# EasyEDA Pro project ProProject_gps打窝船_2025-04-29.epro, board PCB1
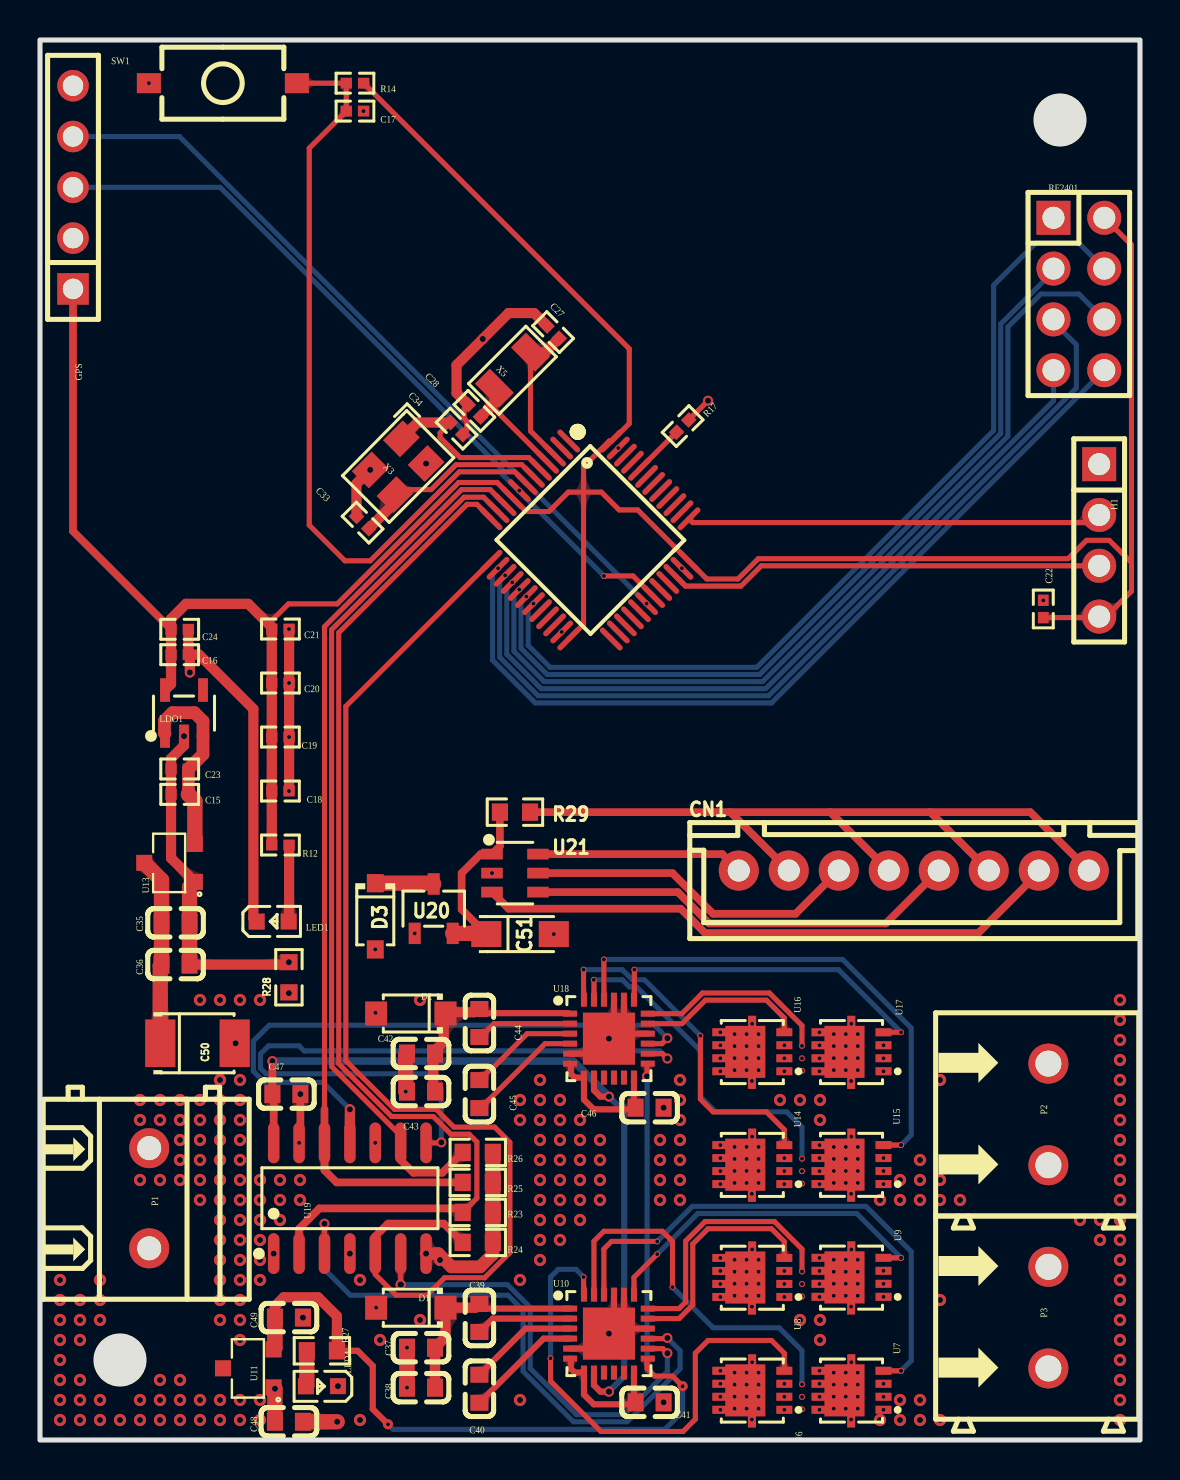
[diagram p4: board, top side]
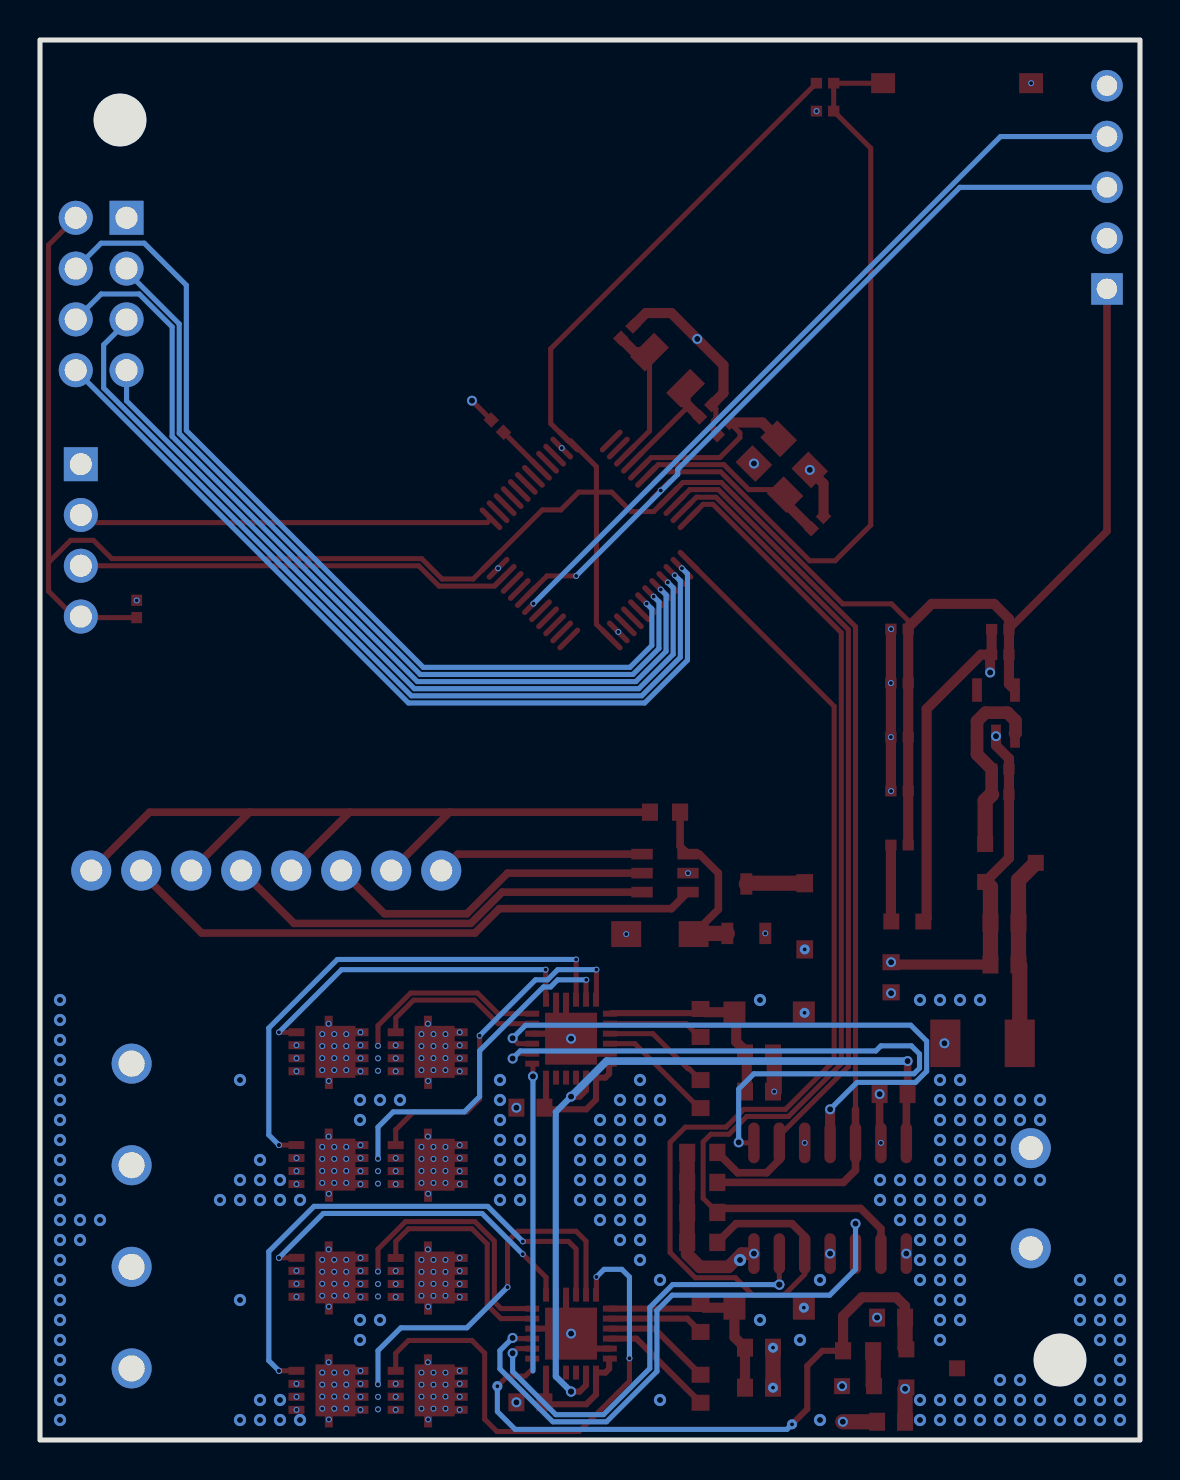
[diagram p5: board, bottom side, seen from below]

Outline 55 x 70 mm; copper layers: Top Layer, GND, VCC, Bottom Layer. Coordinates in mm from the lower left corner of the outline.
Outline path: rectangle 0,70 55,0 ; circle c4,4 r1.2 ; circle c51,66 r1.2
Stack: Top Layer 0.035mm 外层铜厚1oz / Dielectric1 0.2104mm 7628 RC49% 8.6mil / GND 0.0152mm 内层铜厚 / Dielectric2 1.065mm 1.1mm H/HOZ 含铜 / VCC 0.0152mm 内层铜厚 / Dielectric3 0.2104mm 7628 RC49% 8.6mil / Bottom Layer 0.035mm 外层铜厚1oz

## Design rules (mm)
template: 自定义配置
spacing copperThickness1oz (default): track to track 0.102, other pairs 0.152 to 0.3
spacing copperThickness2oz: track to track 0.203, other pairs 0.152 to 0.3
spacing copperThicknessInner0.5oz: track to track 0.089, other pairs 0.152 to 0.3
track width copperThickness1oz (default): min 0.102, default 0.254, max 2.54
track width copperThickness2oz: min 0.203, default 0.254, max 2.54
track width copperThickness0.5oz: min 0.089, default 0.254, max 2.54
differential pair differentialPair (default): width min 0.127, default 0.254, max 2.54; gap min 0.152, default 0.152
via viaSize (default): diameter min 0.3, default 0.61, max 10; hole min 0.2, default 0.305, max 6.3

## Placement (name value [footprint] x y rotation side)
C15  100nF  [R0402]  6.98 32.28 0 top
C16  100nF  [R0402]  6.98 39.27 180 top
C17  100nF  [R0402]  15.75 66.44 180 top
C18  100nF  [R0402]  12.02 32.45 180 top
C19  100nF  [R0402]  12.02 35.15 180 top
C20  100nF  [R0402]  12.02 37.85 180 top
C21  100nF  [R0402]  12.02 40.55 180 top
C22  100nF  [R0402]  50.16 41.55 270 top
C23  1uF  [R0402]  6.98 33.55 0 top
C24  1uF  [R0402]  6.98 40.54 180 top
C27  12pF  [R0402]  25.65 55.39 315 top
C28  12pF  [R0402]  21.72 51.46 315 top
C33  12pF  [R0402]  16.13 45.87 315 top
C34  12pF  [R0402]  20.83 50.57 315 top
C35  10uF  [C0603]  6.78 25.86 180 top
C36  100nF  [C0603]  6.78 23.77 180 top
C37  10uF  [C0603]  19.05 4.62 0 top
C38  100nF  [C0603]  19.05 2.62 0 top
C39  1uF  [C0603]  21.97 6.1 90 top
C40  100nF  [C0603]  21.97 2.56 90 top
C41  1uF  [C0603]  30.48 1.88 180 top
C42  10uF  [C0603]  19.05 19.33 0 top
C43  100nF  [C0603]  19.05 17.42 0 top
C44  1uF  [C0603]  21.97 20.85 90 top
C45  100nF  [C0603]  21.97 17.3 90 top
C46  1uF  [C0603]  30.48 16.61 180 top
C47  1uF  [C0603]  12.32 17.3 180 top
C48  1uF  [C0603]  12.45 0.91 0 top
C49  1uF  [C0603]  12.45 6.12 180 top
C50  220uF  [CASE-B_3528]  7.87 19.83 0 top
C51  1uF  [CAP-SMD_L3.2-W1.6-RD]  24 25.3 0 top
CN1  ZX-XH2.54-8PZZ  [CONN-TH_8P-P2.50-XH2.54-8P]  43.69 28.47 0 top
D1  1N5819HW  [SOD-123_L2.7-W1.6-LS3.8-RD]  18.54 6.62 180 top
D2  1N5819HW  [SOD-123_L2.7-W1.6-LS3.8-RD]  18.54 21.33 180 top
D3  肖特基二极管B130  [SOD-123_L2.7-W1.7-LS3.8-RD]  16.76 26.19 270 top
GPS  2.54-1*5P母  [HDR-TH_5P-P2.54-V-F]  1.65 62.63 90 top
H1  -  [HDR-TH_4P-P2.54-V-M]  52.96 44.98 270 top
LDO1  ME6211C33M5G-N  [SOT-23-5_L3.0-W1.7-P0.95-LS2.8-BL]  7.2 36.34 0 top
LED1  -  [LED_0603]  11.68 25.93 0 top
LED4  LTST-C191KSKT  [LED0603-RD-YELLOW]  14.1 2.69 180 top
NOREF  -  [Pad_e1014]  51 66 0 top
NOREF#2  -  [Pad_e1015]  4 4 0 top
P1  WJ128V-5.0-2P  [CONN-TH_2P-P5.00_WJ128V-5.0-2P]  5.46 12.09 270 top
P2  WJ500V-5.08-2P  [CONN-TH_2P-P5.00_WJ500V-5.08-2P]  50.42 16.28 90 top
P3  WJ500V-5.08-2P  [CONN-TH_2P-P5.00_WJ500V-5.08-2P]  50.42 6.12 90 top
R12  1kΩ  [R0402]  12.02 29.75 180 top
R14  10kΩ  [R0402]  15.75 67.84 0 top
R17  10kΩ  [R0402]  32.13 50.7 225 top
R23  10kΩ  [R0603]  21.89 11.38 0 top
R24  10kΩ  [R0603]  21.89 9.88 0 top
R25  10kΩ  [R0603]  21.89 12.88 180 top
R26  10kΩ  [R0603]  21.89 14.38 180 top
R27  2.2kΩ  [R0603]  14.09 4.46 0 top
R28  0Ω  [R0603]  12.45 23.14 90 top
R29  330Ω  [R0603]  23.75 31.39 0 top
RF2401  PZ254V-12-8P  [HDR-TH_8P-P2.54-V-M-R2-C4-S2.54]  51.94 57.3 270 top
SW1  TS-1101-B-W  [KEY-SMD_2P-L6.0-W3.6-P7.4-LS8.0-L]  9.14 67.84 0 top
U1  STM32F103C8T6  [LQFP-48_L7.0-W7.0-P0.50-LS9.0-BL]  27.5 45 225 top
U6  TPH1R403NL  [PDFN-8_L3.1-W3.0-P0.65-LS3.3-BL-G12P03D3]  35.62 2.46 90 top
U7  TPH1R403NL  [PDFN-8_L3.1-W3.0-P0.65-LS3.3-BL-G12P03D3]  40.58 2.46 90 top
U8  TPH1R403NL  [PDFN-8_L3.1-W3.0-P0.65-LS3.3-BL-G12P03D3]  35.62 8.1 90 top
U9  TPH1R403NL  [PDFN-8_L3.1-W3.0-P0.65-LS3.3-BL-G12P03D3]  40.58 8.1 90 top
U10  DRV8701ERGET  [VQFN-24_L4.0-W4.0-P0.50-BL-EP2.5]  28.45 5.32 270 top
U11  LR8341A-T33  [SOT-23-3L_L2.9-W1.6-P1.90-LS2.8-BL]  10.41 3.58 90 top
U13  LR8341A-T50  [SOT-23-3L_L2.9-W1.6-P1.90-LS2.8-BL]  6.48 28.85 90 top
U14  TPH1R403NL  [PDFN-8_L3.1-W3.0-P0.65-LS3.3-BL-G12P03D3]  35.62 13.74 90 top
U15  TPH1R403NL  [PDFN-8_L3.1-W3.0-P0.65-LS3.3-BL-G12P03D3]  40.58 13.74 90 top
U16  TPH1R403NL  [PDFN-8_L3.1-W3.0-P0.65-LS3.3-BL-G12P03D3]  35.62 19.38 90 top
U17  TPH1R403NL  [PDFN-8_L3.1-W3.0-P0.65-LS3.3-BL-G12P03D3]  40.58 19.38 90 top
U18  DRV8701ERGET  [VQFN-24_L4.0-W4.0-P0.50-BL-EP2.5]  28.45 20.07 270 top
U19  SN74HC125DR  [SOIC-14_L8.7-W3.9-P1.27-LS6.0-BL]  15.49 12.09 0 top
U20  MST52L30BTE  [SOT-23-3_L2.9-W1.6-P1.90-LS2.8-BR]  19.69 26.57 270 top
U21  HX70A  [SOT-23-6_L2.9-W1.6-P0.95-LS2.8-BL]  23.75 28.34 270 top
X3  8MHz  [CRYSTAL-SMD_4P-L3.2-W2.5-BL-1]  17.91 48.66 225 top
X5  32.768kHz  [OSC-SMD_L3.2-W1.5]  23.62 53.49 225 top

## Footprints (pads in the part's own frame, mm; a bottom-side part is the same pattern mirrored in y, then rotated)
C0603
  rect 0.8x0.9 smd: 1(-0.7,0) 2(0.7,0)
CAP-SMD_L3.2-W1.6-RD
  rect 1.5x1.296 smd: 1(-1.687,0) 2(1.687,0)
CASE-B_3528
  rect 1.506x2.376 smd: 1(-1.861,0) 2(1.861,0)
CONN-TH_2P-P5.00_WJ128V-5.0-2P
  round 2 hole 1.2: 1(-2.505,0) 2(2.505,0)
CONN-TH_2P-P5.00_WJ500V-5.08-2P
  round 2 hole 1.3: 1(-2.54,0) 2(2.54,0)
CONN-TH_8P-P2.50-XH2.54-8P
  round 2 hole 1.1: 1(8.75,0) 2(6.25,0) 3(3.75,0) 4(1.25,0) 5(-1.25,0) 6(-3.75,0) 7(-6.25,0) 8(-8.75,0)
CRYSTAL-SMD_4P-L3.2-W2.5-BL-1
  rect 1.4x1.2 smd: 1(-1.1,-0.875) 2(1.1,-0.875) 3(1.1,0.875) 4(-1.1,0.875)
HDR-TH_4P-P2.54-V-M
  rect 1.7x1.7 hole 1.1: 1(-3.81,0)
  round 1.7 hole 1.1: 2(-1.27,0) 3(1.27,0) 4(3.81,0)
HDR-TH_5P-P2.54-V-F
  rect 1.575x1.575 hole 1.02: 1(-5.08,0)
  round 1.575 hole 1.02: 2(-2.54,0) 3(0,0) 4(2.54,0) 5(5.08,0)
HDR-TH_8P-P2.54-V-M-R2-C4-S2.54
  rect 1.7x1.7 hole 1.1: 1(-3.81,-1.27)
  round 1.7 hole 1.1: 2(-3.81,1.27) 3(-1.27,-1.27) 4(-1.27,1.27) 5(1.27,-1.27) 6(1.27,1.27) 7(3.81,-1.27) 8(3.81,1.27)
KEY-SMD_2P-L6.0-W3.6-P7.4-LS8.0-L
  rect 1.2x1 smd: 1(-3.7,0) 2(3.7,0)
LED0603-RD-YELLOW
  rect 0.8x0.8 smd: 1(-0.799,-0.004) 2(0.799,0.004)
LED_0603
  rect 0.8x0.8 smd: 1(-0.851,-0.01) 2(0.75,-0.005)
LQFP-48_L7.0-W7.0-P0.50-LS9.0-BL
  oval 0.27x1.5 smd: 1(-2.75,-4.25) 2(-2.25,-4.25) 3(-1.75,-4.25) 4(-1.25,-4.25) 5(-0.75,-4.25) 6(-0.25,-4.25) 7(0.25,-4.25) 8(0.75,-4.25) 9(1.25,-4.25) 10(1.75,-4.25) 11(2.25,-4.25) 12(2.75,-4.25) 25(2.75,4.25) 26(2.25,4.25) 27(1.75,4.25) 28(1.25,4.25) 29(0.75,4.25) 30(0.25,4.25) 31(-0.25,4.25) 32(-0.75,4.25) 33(-1.25,4.25) 34(-1.75,4.25) 35(-2.25,4.25) 36(-2.75,4.25)
  oval 1.5x0.27 smd: 13(4.25,-2.75) 14(4.25,-2.25) 15(4.25,-1.75) 16(4.25,-1.25) 17(4.25,-0.75) 18(4.25,-0.25) 19(4.25,0.25) 20(4.25,0.75) 21(4.25,1.25) 22(4.25,1.75) 23(4.25,2.25) 24(4.25,2.75) 37(-4.25,2.75) 38(-4.25,2.25) 39(-4.25,1.75) 40(-4.25,1.25) 41(-4.25,0.75) 42(-4.25,0.25) 43(-4.25,-0.25) 44(-4.25,-0.75) 45(-4.25,-1.25) 46(-4.25,-1.75) 47(-4.25,-2.25) 48(-4.25,-2.75)
OSC-SMD_L3.2-W1.5
  rect 1.05x1.7 smd: 1(-1.275,0) 2(1.275,0)
Pad_e1014
  round 2.4 hole 2.7: 49(0,0)
Pad_e1015
  round 2.4 hole 2.7: 49(0,0)
PDFN-8_L3.1-W3.0-P0.65-LS3.3-BL-G12P03D3
  rect 0.8x0.4 smd: 1(-1.43,0.02) 1(1.43,0.01)
  rect 0.4x0.8 smd: 1(-0.945,1.6) 1(-0.295,1.6) 1(0.355,1.6) 1(1.005,1.6) 2(1.005,-1.6) 3(-0.945,-1.6) 3(-0.294,-1.6) 3(0.355,-1.6)
  rect 2.6x2 smd: 1(0.025,0.35)
R0402
  rect 0.566x0.54 smd: 1(-0.433,0) 2(0.433,0)
R0603
  rect 0.806x0.864 smd: 1(-0.753,0) 2(0.753,0)
SOD-123_L2.7-W1.6-LS3.8-RD
  rect 1.1x1.2 smd: 1(-1.735,0) 2(1.735,0)
SOD-123_L2.7-W1.7-LS3.8-RD
  rect 0.91x0.84 smd: 1(-1.655,0) 2(1.655,0)
SOIC-14_L8.7-W3.9-P1.27-LS6.0-BL
  oval 0.574x2.038 smd: 1(-3.81,-2.769) 2(-2.54,-2.769) 3(-1.27,-2.769) 4(0,-2.769) 5(1.27,-2.769) 6(2.54,-2.769) 7(3.81,-2.769) 8(3.81,2.769) 9(2.54,2.769) 10(1.27,2.769) 11(0,2.769) 12(-1.27,2.769) 13(-2.54,2.769) 14(-3.81,2.769)
SOT-23-3_L2.9-W1.6-P1.90-LS2.8-BR
  rect 1.07x0.6 smd: 1(1.235,-0.95) 2(1.235,0.95) 3(-1.235,0)
SOT-23-3L_L2.9-W1.6-P1.90-LS2.8-BL
  rect 0.8x0.8 smd: 1(-0.95,-1.265) 2(0.95,-1.265) 3(0.005,1.265)
SOT-23-5_L3.0-W1.7-P0.95-LS2.8-BL
  rect 0.49x1.157 smd: 1(-0.95,-1.153) 2(0,-1.153) 3(0.95,-1.153)
  rect 0.49x1.175 smd: 4(0.95,1.153) 5(-0.95,1.153)
SOT-23-6_L2.9-W1.6-P0.95-LS2.8-BL
  rect 0.532x1.072 smd: 1(-0.95,-1.149) 2(0,-1.149) 3(0.95,-1.149) 4(0.95,1.149) 5(0,1.149) 6(-0.95,1.149)
VQFN-24_L4.0-W4.0-P0.50-BL-EP2.5
  rect 0.3x0.7 smd: 1(-1.25,-1.942) 2(-0.75,-1.942) 3(-0.25,-1.942) 4(0.25,-1.942) 5(0.75,-1.942) 6(1.25,-1.942) 13(1.25,1.942) 14(0.75,1.942) 15(0.25,1.942) 16(-0.25,1.942) 17(-0.75,1.942) 18(-1.25,1.942)
  rect 0.7x0.3 smd: 7(1.948,-1.25) 8(1.948,-0.75) 9(1.948,-0.25) 10(1.948,0.25) 11(1.948,0.75) 12(1.948,1.25) 19(-1.948,1.25) 20(-1.948,0.75) 21(-1.948,0.25) 22(-1.948,-0.25) 23(-1.948,-0.75) 24(-1.948,-1.25)
  rect 2.6x2.6 smd: 25(0.001,-0.001)

## Nets
As in the schematic.

Pads without a net: GPS 5; LDO1 4; NOREF 49; NOREF#2 49; U10 9 10 11; U18 9 10 11

## Via types
v1: diameter 0.5, hole 0.305, Top Layer to Bottom Layer, 35 vias
v2: diameter 0.61, hole 0.304, Top Layer to Bottom Layer, 193 vias
v3: diameter 0.3, hole 0.2, Top Layer to Bottom Layer, 223 vias
v4: diameter 0.5, hole 0.2, Top Layer to Bottom Layer, 7 vias

## Routing (per net, layer and track width the routed paths; a pad name or vN(x,y) marks a point on that pad's centre or on a via; arc(x,y) is an arc through that point)
3V3: length 148.5
  Top Layer w0.254: 53.21,61.11 54.57,59.75 54.57,43.88 ; 27.18,47.39 26.42,47.39 25.45,46.42 24.31,46.42 22.86,47.88 20.93,47.88 14.86,41.81 12.43,41.81 11.59,40.97 11.59,40.63 ; 27.18,47.39 27.18,48.66 28.46,49.95 U1.48 28.59,49.95 29.46,50.82 29.46,54.56 R14.2 ; 27.18,47.39 28.07,47.39 28.96,46.5 29.88,46.5 U1.36 33.34,43.05 34.9,43.05 35.92,44.07 51.41,44.07 52.33,44.98 53.47,44.98 54.57,43.88 ; 27.18,47.39 27.18,40.79 U1.24 ; 54.57,43.88 54.57,42.44 53.3,41.17 52.96,41.17 52.91,41.12 C22.2
  Top Layer w0.381: GPS.1 1.65,45.44 C24.2
  Top Layer w0.508: 11.59,29.75 11.59,40.63 10.41,41.81 7.3,41.81 6.55,41.06 C24.2 C16.2 6.55,37.8 LDO1.5
+5V: length 9.5
  Top Layer w0.635: 6.25,35.32 6.22,35.34 6.22,35.96 6.63,36.37 7.73,36.37 8.15,35.94 LDO1.3 8.15,34.28 C23.2 C15.2
  Top Layer w0.762: U13.2 7.74,31.96 C15.2
DVDD: length 40.1
  Top Layer w0.305: v1(28.45,17.17) 28.02,17.17 27.7,17.49 U18.8 ; v1(28.45,2.42) 28.02,2.42 27.7,2.74 U10.8
  Top Layer w0.381: v1(11.62,18.95) C47.2 11.68,17.23 U19.14
  Bottom Layer w0.305: v1(28.45,17.17) 29.21,16.41 29.21,3.18 v1(28.45,2.42)
  Bottom Layer w0.381: v1(28.45,17.17) 26.67,18.95 v1(11.62,18.95)
GND: length 89.4
  Top Layer w0.254: 32.44,51 v1(33.4,51.97) ; 21.13,50.26 21.34,50.47 21.34,50.95 21.21,51.08 21.21,51.56 21.41,51.76
  Top Layer w0.305: 28.7,5.57 v1(28.45,5.32) 27.7,4.57 U10.5 ; 28.7,5.57 U10.16 ; 28.7,5.57 U10.21 ; 28.7,5.57 29.2,6.07 U10.20 ; 29.2,22.02 29.2,20.82 28.7,20.32 ; 28.7,22.02 28.7,20.32 ; 28.7,20.32 U18.16 ; 28.7,20.32 v1(28.45,20.07) 27.7,19.32 U18.5
  Top Layer w0.381: v3(12.95,14.86) 13.02,14.92 v1(13.02,17.3)
  Top Layer w0.508: v1(12.45,23.89) 12.33,23.77 C36.1 ; v1(7.49,38.38) 7.49,39.19 C16.1 ; 12.46,40.55 v3(12.46,37.85) v3(12.46,35.15) 12.46,32.45 ; v1(16.51,48.5) 15.82,47.82 15.82,46.18 ; 25.35,55.7 24.7,56.35 23.43,56.35 v1(22.14,55.05) 20.83,53.74 20.83,52.35 21.41,51.76 ; C16.1 7.95,39.27 10.67,36.55 10.67,26.09 LED1.1 ; C16.1 C24.1 ; U13.1 6.55,29.09 C15.1 C23.1 6.55,34.08 7.2,34.72 v1(7.2,35.19)
  Top Layer w0.635: R24.2 22.64,9.29 22.01,8.66 20.57,8.66 19.91,9.32 v1(19.3,9.32)
  Top Layer w0.762: R26.1 R25.1 R23.2 R24.2 ; v3(18.29,17.42) 18.29,19.26 C42.1 ; U13.1 7.48,27.64 C35.1 C36.1 ; C48.1 v1(11.75,2.56) 11.68,2.63 ; v4(18.35,4.62) v4(18.35,2.62)
  vias: v1(9.78,19.83) v1(11.68,9.32) v1(12.45,22.34) v1(13.15,6.12) v1(14.9,2.69) v1(15.49,9.32) v1(19.3,48.82) v1(31.18,16.61) v1(31.18,1.88) v2(1,8) v2(1,7) v2(1,6) v2(1,5) v2(1,4) v2(1,3) v2(1,2) v2(1,1) v2(2,7) v2(2,6) v2(2,5) v2(2,3) v2(2,2) v2(2,1) v2(3,8) v2(3,7) v2(3,6) v2(3,2) v2(3,1) v2(4,1) v2(5,17) v2(5,16) v2(5,13) v2(5,2) v2(5,1) v2(6,17) v2(6,16) v2(6,13) v2(6,3) v2(6,2) v2(6,1) v2(7,17) v2(7,16) v2(7,15) v2(7,14) v2(7,13) v2(7,3) v2(7,2) v2(7,1) v2(8,22) v2(8,17) v2(8,16) v2(8,15) v2(8,14) v2(8,13) v2(8,12) v2(8,2) v2(8,1) v2(9,22) v2(9,18) v2(9,17) v2(9,16) v2(9,15) v2(9,14) v2(9,13) v2(9,12) v2(9,11) v2(9,10) v2(9,9) v2(9,8) v2(9,7) v2(9,6) v2(9,2) v2(9,1) v2(10,22) v2(10,18) v2(10,17) v2(10,16) v2(10,15) v2(10,14) v2(10,13) v2(10,12) v2(10,11) v2(10,10) v2(10,9) v2(10,8) v2(10,7) v2(10,6) v2(10,5) v2(10,2) v2(10,1) v2(11,22) v2(11,13) v2(11,12) v2(11,11) v2(11,10) v2(11,9) v2(11,8) v2(11,2) v2(11,1) v2(12,13) v2(12,12) v2(12,11) v2(13,13) v2(13,12) v2(16,8) v2(16,1) v2(17,5) v2(19,22) v2(19,6) v2(20,9) v2(24,17) v2(24,16) v2(24,8) v2(24,2) v2(25,18) v2(25,17) v2(25,16) v2(25,15) v2(25,14) v2(25,13) v2(25,12) v2(25,11) v2(25,10) v2(25,9) v2(26,17) v2(26,16) v2(26,15) v2(26,14) v2(26,13) v2(26,12) v2(26,11) v2(26,10) v2(27,16) v2(27,15) v2(27,14) v2(27,13) v2(27,12) v2(27,11) v2(28,15) v2(28,14) v2(28,13) v2(28,12) v2(31,15) v2(31,14) v2(31,13) v2(31,12) v2(32,18) v2(32,17) v2(32,16) v2(32,15) v2(32,14) v2(32,13) v2(32,12) v2(37,17) v2(38,17) v2(38,6) v2(39,17) v2(39,16) v2(39,6) v2(39,5) v2(42,12) v2(42,1) v2(43,13) v2(43,12) v2(43,2) v2(43,1) v2(44,14) v2(44,13) v2(44,12) v2(44,2) v2(44,1) v2(45,18) v2(45,13) v2(45,12) v2(45,7) v2(45,1) v2(46,12) v2(52,11) v2(53,11) v2(53,10) v2(54,22) v2(54,21) v2(54,20) v2(54,19) v2(54,18) v2(54,17) v2(54,16) v2(54,15) v2(54,14) v2(54,13) v2(54,12) v2(54,11) v2(54,10) v2(54,9) v2(54,8) v2(54,7) v2(54,6) v2(54,5) v2(54,4) v2(54,3) v2(54,2) v2(54,1) v3(5.44,67.84) v3(12.45,40.55) v3(12.45,32.45) v3(16.17,66.44) v3(16.76,14.86) v3(18.74,25.33) v3(22.6,28.34) v3(23.96,47.47) v3(25.69,25.3) v3(26.09,40.4) v3(28.91,49.6) v3(32.1,43.59) v3(42.18,19.74) v3(42.18,19.09) v3(42.18,18.44) v3(42.18,14.1) v3(42.18,13.45) v3(42.18,12.8) v3(42.18,8.46) v3(42.18,7.81) v3(42.18,7.16) v3(42.18,2.81) v3(42.18,2.16) v3(42.18,1.51) v3(50.16,41.98)
VCC: length 11.2
  Top Layer w0.762: C50.1 6.01,23.71 C36.2 C35.2 6.08,27.99 U13.3 ; v1(14.86,0.91) C48.2 ; v4(16.77,21.36) D2.2
  vias: v3(34.02,20.39) v3(34.02,19.74) v3(34.02,19.09) v3(34.02,18.44) v3(34.02,14.75) v3(34.02,14.09) v3(34.02,13.44) v3(34.02,12.79) v3(34.02,9.1) v3(34.02,8.45) v3(34.02,7.8) v3(34.02,7.15) v3(34.02,3.46) v3(34.02,2.81) v3(34.02,2.16) v3(34.02,1.51) v3(34.73,20.3) v3(34.73,19.69) v3(34.73,19.09) v3(34.73,18.5) v3(34.73,14.65) v3(34.73,14.05) v3(34.73,13.45) v3(34.73,12.85) v3(34.73,9.01) v3(34.73,8.41) v3(34.73,7.81) v3(34.73,7.21) v3(34.73,3.37) v3(34.73,2.77) v3(34.73,2.17) v3(34.73,1.57) v3(35.33,20.3) v3(35.33,19.69) v3(35.33,19.09) v3(35.33,18.5) v3(35.33,14.65) v3(35.33,14.05) v3(35.33,13.45) v3(35.33,12.85) v3(35.33,9.01) v3(35.33,8.41) v3(35.33,7.81) v3(35.33,7.21) v3(35.33,3.37) v3(35.33,2.77) v3(35.33,2.17) v3(35.33,1.57) v3(35.6,20.81) v3(35.59,17.95) v3(35.6,15.17) v3(35.59,12.31) v3(35.6,9.53) v3(35.59,6.67) v3(35.6,3.89) v3(35.59,1.03) v3(35.93,20.3) v3(35.93,19.69) v3(35.93,19.09) v3(35.93,18.5) v3(35.93,14.65) v3(35.93,14.05) v3(35.93,13.45) v3(35.93,12.85) v3(35.93,9.01) v3(35.93,8.41) v3(35.93,7.81) v3(35.93,7.21) v3(35.93,3.37) v3(35.93,2.77) v3(35.93,2.17) v3(35.93,1.57) v4(16.76,24.53) v4(16.81,6.62)
CHECK: length 9.4
  Top Layer w0.381: R29.1 23,29.69 U21.1 22.03,29.29 21.08,28.34 21.08,26.53 22.28,25.33
  Top Layer w0.762: U20.2 22.28,25.33 C51.1
EN_1: length 22.2
  Top Layer w0.254: v1(18.03,7.77) U19.6 ; v1(31.37,4.34) 31.14,4.57 U10.14
  Bottom Layer w0.254: v1(18.03,7.77) 23.37,7.77 24.51,6.63 24.51,3.58 26.82,1.27 29.21,1.27 31.37,3.43 v1(31.37,4.34)
EN_1_IN: length 58.4
  Top Layer w0.254: U1.13 15.29,36.68 15.29,18.96 17.72,16.53 19.81,16.53 20.7,15.64 22.73,15.64 23.5,14.88 23.5,9.38 22.23,8.11 20.23,8.11 19.36,7.24 17.8,7.24 16.76,8.28 U19.5
  Top Layer w0.381: U19.5 16.76,10.18 17.4,10.82 20.2,10.82 R24.1
EN_2: length 35.5
  Top Layer w0.254: v1(31.37,19.07) 31.12,19.32 U18.14 ; v1(20.07,14.88) 20.04,14.86 U19.8
  Bottom Layer w0.254: v1(20.07,14.88) 20.07,17.55 19.3,18.31 11.3,18.31 11.02,18.59 11.02,19.3 11.43,19.71 12.95,19.71 13.21,19.45 30.99,19.45 v1(31.37,19.07)
EN_2_IN: length 43.1
  Top Layer w0.254: U1.11 22.18,47.14 21.2,47.14 14.58,40.52 14.58,18.67 18.03,15.22 U19.9
  Top Layer w0.381: U19.9 18.03,14 18.67,13.36 20.12,13.36 R26.2
MOTOR_L1: length 18.8
  Top Layer w0.254: U10.23 27.7,9.94 28.19,10.44 31.12,10.44 31.62,9.93 v3(31.62,7.64)
  Bottom Layer w0.254: v3(31.62,7.64) 33.66,5.61 36.96,5.61 38.1,4.47 v3(38.1,2.78)
  vias: v3(37.22,2.81) v3(37.22,2.16) v3(37.22,1.51) v3(38.1,2.16) v3(38.1,1.53) v3(38.98,3.46) v3(38.98,2.81) v3(38.98,2.16) v3(38.98,1.51) v3(39.69,3.37) v3(39.69,2.77) v3(39.69,2.17) v3(39.69,1.57) v3(40.29,3.37) v3(40.29,2.77) v3(40.29,2.17) v3(40.29,1.57) v3(40.57,3.89) v3(40.56,1.03) v3(40.89,3.37) v3(40.89,2.77) v3(40.89,2.17) v3(40.89,1.57)
MOTOR_L2: length 13
  Top Layer w0.254: v3(38.1,8.42) 38.1,9.54 36.72,10.92 33.25,10.92 32.28,9.95 32.28,6.9 31.95,6.57 U10.18
  vias: v3(37.22,8.45) v3(37.22,7.8) v3(37.22,7.15) v3(38.1,7.8) v3(38.1,7.18) v3(38.98,9.1) v3(38.98,8.45) v3(38.98,7.8) v3(38.98,7.15) v3(39.69,9.01) v3(39.69,8.41) v3(39.69,7.81) v3(39.69,7.21) v3(40.29,9.01) v3(40.29,8.41) v3(40.29,7.81) v3(40.29,7.21) v3(40.57,9.53) v3(40.56,6.67) v3(40.89,9.01) v3(40.89,8.41) v3(40.89,7.81) v3(40.89,7.21)
MOTOR_R1: length 17.4
  Top Layer w0.254: 27.7,22.02 27.7,23 v3(27.69,23.01)
  Bottom Layer w0.254: v3(27.69,23.01) 29.12,23.01 29.47,22.65 29.82,22.65 33.02,19.46 33.02,17.17 33.78,16.41 37.34,16.41 38.1,15.64 v3(38.1,14.07)
  vias: v3(37.22,14.09) v3(37.22,13.44) v3(37.22,12.79) v3(38.1,13.44) v3(38.1,12.82) v3(38.98,14.75) v3(38.98,14.09) v3(38.98,13.44) v3(38.98,12.79) v3(39.69,14.65) v3(39.69,14.05) v3(39.69,13.45) v3(39.69,12.85) v3(40.29,14.65) v3(40.29,14.05) v3(40.29,13.45) v3(40.29,12.85) v3(40.57,15.17) v3(40.56,12.31) v3(40.89,14.65) v3(40.89,14.05) v3(40.89,13.45) v3(40.89,12.85)
MOTOR_R2: length 9.8
  Top Layer w0.254: v3(38.1,19.71) 38.1,20.72 36.47,22.35 33.13,22.35 32.09,21.32 U18.18
  vias: v3(37.22,19.74) v3(37.22,19.09) v3(37.22,18.44) v3(38.1,19.08) v3(38.1,18.46) v3(38.98,20.39) v3(38.98,19.74) v3(38.98,19.09) v3(38.98,18.44) v3(39.69,20.3) v3(39.69,19.69) v3(39.69,19.09) v3(39.69,18.5) v3(40.29,20.3) v3(40.29,19.69) v3(40.29,19.09) v3(40.29,18.5) v3(40.57,20.81) v3(40.56,17.95) v3(40.89,20.3) v3(40.89,19.69) v3(40.89,19.09) v3(40.89,18.5)
NRST: length 39
  Top Layer w0.254: SW1.2 R14.1 C17.2 13.46,64.59 13.46,45.74 15.24,43.96 16.51,43.96 20.96,48.41 23.74,48.41 U1.7
NSLEEP: length 47.4
  Top Layer w0.254: v1(30.35,18.18) 30.35,18.78 U18.13 ; v4(32.13,2.69) 31.62,3.2 30.73,3.2 30.35,3.58 30.35,4.03 U10.13
  Top Layer w0.305: v4(17.4,0.78) 16.64,1.55 16.64,3.71 15.88,4.46 R27.2
  Top Layer w0.508: R27.2 14.85,6.19 13.9,7.13 12.19,7.13 11.75,6.7 C49.2
  Top Layer w0.762: C49.2 11.75,4.6 11.68,4.53
  Bottom Layer w0.254: v4(17.4,0.78) 17.65,0.53 31.24,0.53 32.13,1.42 v4(32.13,2.69) ; v1(30.35,18.18) 30.35,3.45
OSC32_IN: length 7.4
  Top Layer w0.254: X5.1 24.52,50.45 U1.3
  Top Layer w0.508: X5.1 25.26,54.39 C27.2
OSC32_OUT: length 5.8
  Top Layer w0.254: 22.72,51.85 22.72,51.55 25.38,48.89
  Top Layer w0.508: C28.2 22.72,51.85 X5.2
OSC_IN: length 9.4
  Top Layer w0.254: 25.03,48.54 24.44,49.12 21.01,49.12 20,50.12 20,50.36 C34.1
  Top Layer w0.508: X3.1 18.88,50.88 C34.1
OSC_OUT: length 10
  Top Layer w0.254: X3.3 18,47.52 19.56,47.52 20.8,48.77 24.09,48.77 U1.6
  Top Layer w0.508: X3.3 17.75,46.88 C33.2
PA9/USART1_TX: length 38.4
  Bottom Layer w0.254: v3(30.33,41.82) 6.97,65.17 GPS.4
PA10/USART1_RX: length 37.7
  Top Layer w0.254: v3(28.19,43.2) 29.65,43.2 U1.31
  Bottom Layer w0.254: GPS.3 9.01,62.63 23.11,48.53 23.11,48.28 v3(28.19,43.2)
PA13/SWDIO: length 21.9
  Top Layer w0.254: H1.3 36.06,43.71 35.05,42.69 32.28,42.69 U1.34
PA14/SWCLK: length 20.7
  Top Layer w0.254: U1.37 32.64,45.87 52.58,45.87 52.96,46.25
PH_1: length 30.4
  Top Layer w0.254: v1(31.37,5.1) 31.34,5.07 U10.15 ; v1(14.22,10.82) U19.3
  Bottom Layer w0.254: v1(14.22,10.82) 14.22,8.53 15.52,7.24 23.39,7.24 24.16,6.48 24.16,3.43 26.67,0.91 29.36,0.91 32,3.56 32,4.47 v1(31.37,5.1)
PH_1_IN: length 54.4
  Top Layer w0.254: U1.12 22.55,46.08 21.84,46.78 21.35,46.78 14.94,40.37 14.94,18.82 17.58,16.18 19.66,16.18 20.55,15.29 21.46,15.29 21.84,14.9 21.84,12.09 R23.1
  Top Layer w0.381: U19.2 12.95,10.56 13.97,11.58 20.93,11.58 R23.1
PH_2: length 31.2
  Top Layer w0.254: U18.15 31.1,19.82 v1(31.37,20.09)
  Top Layer w0.508: v1(15.49,16.53) U19.11
  Bottom Layer w0.254: v1(31.37,20.09) 30.72,20.74 11.47,20.74 10.67,19.94 10.67,18.44 11.23,17.88 14.15,17.88 v1(15.49,16.53)
PH_2_IN: length 46.5
  Top Layer w0.254: U1.10 22.5,47.52 21.08,47.52 14.22,40.66 14.22,16.53
  Top Layer w0.381: 14.22,16.53 U19.12 14.22,13.48 14.83,12.88 R25.2
SPI1_CE: length 41.6
  Bottom Layer w0.254: v3(50.67,58.57) 50.67,58.44 48.04,55.8 48.04,50.33 35.99,38.28 25.35,38.28 24.05,39.58 24.05,41.9 v3(24.32,42.17)
SPI1_CSN: length 45
  Bottom Layer w0.254: v3(24.67,41.82) 24.41,41.55 24.41,39.73 25.5,38.63 35.84,38.63 47.68,50.48 47.68,57.74 49.78,59.84 51.94,59.84 53.21,58.57
SPI1_IRQ: length 43.1
  Bottom Layer w0.254: v3(22.9,43.59) 22.63,43.31 22.63,38.99 24.76,36.85 36.58,36.85 53.21,53.49
SPI1_MISO: length 39.2
  Bottom Layer w0.254: RF2401.7 50.67,51.96 36.28,37.56 25.06,37.56 23.34,39.29 23.34,42.61 v3(23.61,42.88)
SPI1_MOSI: length 45.1
  Bottom Layer w0.254: 53.21,56.03 51.94,57.3 50.04,57.3 48.39,55.66 48.39,50.18 36.13,37.92 25.21,37.92 23.69,39.43 23.69,42.26 v3(23.96,42.53)
SPI1_SCK: length 44.1
  Bottom Layer w0.254: RF2401.5 50.67,55.9 51.82,54.76 51.82,52.6 36.43,37.21 24.91,37.21 22.98,39.14 22.98,42.96 v3(23.26,43.23)
$1N9675: length 3.8
  Top Layer w0.508: 12.46,29.75 12.46,25.95 LED1.2
$1N11282: length 2.6
  Top Layer w0.254: 29.97,48.54 29.97,48.54 R17.2
$1N20842: length 10.6
  Top Layer w0.305: C39.2 22.21,6.57 U10.1
  Top Layer w0.508: C38.2 C37.2 20.28,5.14 20.28,6.62 21.78,6.62 C39.2
$1N20851: length 4.8
  Top Layer w0.305: U10.2 22.64,6.07 C39.1
$1N20889: length 5.5
  Top Layer w0.305: U10.3 24.28,5.57 21.97,3.26
$1N20892: length 5.9
  Top Layer w0.305: U10.4 25.18,5.07 C40.1
$1N21047: length 6.7
  Top Layer w0.305: C41.2 29.7,1.97 U10.12 ; U10.6 26.54,4.03 26.54,3.56 26.74,3.37 U10.7 27.2,2.27 27.69,1.79 29.7,1.79 29.78,1.87
$1N21116: length 11.6
  Top Layer w0.254: U8.2 37.21,9.11 37.21,9.93 36.58,10.56 33.4,10.56 32.64,9.8 32.64,6.75 31.96,6.07 U10.17
$1N21181: length 17.3
  Top Layer w0.254: v3(30.86,9.29) 29.7,8.13 U10.19 ; 42.18,9.11 v3(43.05,9.11)
  Bottom Layer w0.254: v3(30.86,9.29) 32.89,11.33 40.84,11.33 v3(43.05,9.11)
$1N21232: length 26.5
  Top Layer w0.254: U10.22 28.19,7.27 28.19,9.55 28.57,9.93 v3(30.86,9.93) ; U7.2 v3(43.05,3.46)
  Bottom Layer w0.254: v3(30.86,9.93) 32.61,11.68 41.3,11.68 43.56,9.42 43.56,3.97 v3(43.05,3.46)
$1N21252: length 25.8
  Top Layer w0.254: U6.2 37.22,4.34 36.58,4.98 33.4,4.98 32.77,4.34 32.77,1.04 32.15,0.43 28.04,0.43 25.53,2.94 v3(25.53,4.09) ; U10.24 27.18,7.29 v3(27.18,8.15)
  Bottom Layer w0.254: v3(27.18,8.15) 26.8,8.53 25.91,8.53 25.53,8.15 v3(25.53,4.09)
$1N21827: length 10.6
  Top Layer w0.305: 26.42,21.34 22.12,21.34 21.88,21.58
  Top Layer w0.508: 21.88,21.58 21.7,21.39 20.19,21.39 20.19,19.92 19.66,19.39 19.66,17.39
$1N21835: length 4.8
  Top Layer w0.254: U18.2 22.7,20.82 22.03,20.15 21.97,20.15
$1N21838: length 5.5
  Top Layer w0.254: C45.2 22.54,18.56 22.61,18.56 24.36,20.32 U18.3
$1N21840: length 5.9
  Top Layer w0.254: C45.1 22.03,16.59 25.25,19.82 U18.4
$1N21849: length 6.7
  Top Layer w0.305: U18.12 29.7,16.7 C46.2 29.7,16.53 27.69,16.53 27.2,17.02 U18.7 26.74,18.12 26.54,18.31 26.54,18.78 U18.6
$1N21874: length 8.4
  Top Layer w0.254: U18.17 32.1,20.82 33.27,21.99 36.32,21.99 37.21,21.11 37.21,20.39 U16.2
$1N21879: length 17
  Top Layer w0.254: 29.7,22.02 29.72,22.04 v3(29.72,23.52) ; 42.18,20.39 v3(43.05,20.39)
  Bottom Layer w0.254: v3(29.72,23.52) 39.92,23.52 v3(43.05,20.39)
$1N21893: length 25.7
  Top Layer w0.254: v3(28.19,24.03) 28.19,22.02 28.2,22.02 ; U15.2 v3(43.05,14.75)
  Bottom Layer w0.254: v3(43.05,14.75) 43.56,15.26 43.56,20.6 40.13,24.03 v3(28.19,24.03)
$1N21897: length 17.5
  Top Layer w0.254: v3(27.18,23.52) 27.18,22.03 27.2,22.02 ; v3(33.02,20.22) 33.02,17.04 33.66,16.41 36.32,16.41 37.22,15.51 U14.2
  Bottom Layer w0.254: v3(27.18,23.52) 29.11,23.52 29.62,23.01 30.23,23.01 v3(33.02,20.22)
$1N22854: length 1.8
  Top Layer w0.762: R27.1 13.34,2.73 LED4.2
$1N29114: length 2.9
  Top Layer w0.762: D3.1 19.65,27.84 U20.3
$1N31681: length 10.4
  Top Layer w0.381: CN1.8 34.12,29.29 U21.6
$1N31692: length 29.5
  Top Layer w0.381: CN1.2 49.94,28.37 46.91,25.35 33.25,25.35 32.03,26.57 23.43,26.57 U21.3
$1N31699: length 16.8
  Top Layer w0.381: U21.5 31.62,28.34 33.66,26.31 37.78,26.31 CN1.6
$1N31708: length 21.8
  Top Layer w0.381: CN1.4 42.3,25.83 33.46,25.83 31.89,27.39 U21.4
$1N31797: length 41.5
  Top Layer w0.381: 44.52,31.39 39.52,31.39 ; 44.52,31.39 49.52,31.39 CN1.1 ; 44.52,31.39 CN1.3 ; 39.52,31.39 CN1.5 ; 39.52,31.39 34.52,31.39 ; 34.52,31.39 CN1.7 ; 34.52,31.39 R29.2

## Copper pours and planes (outline as drawn; the poured copper is in the pictures)
GND on Top Layer: 0,22.88 55,22.88 55,0 0,0
GND on Top Layer: 41.78,3.01 42.61,3.01 42.61,1.29 41.78,1.29
GND on Top Layer: 41.78,14.3 42.61,14.3 42.61,12.57 41.78,12.57
GND on Top Layer: 41.78,8.66 42.61,8.66 42.61,6.93 41.78,6.93
GND on Top Layer: 41.78,19.94 42.61,19.94 42.61,18.21 41.78,18.21
GND on Bottom Layer: 0,22.89 55,22.89 55,0 0,0
GND on GND: 0,22.9 55,22.9 55,0 0,0
GND on GND: 0.13,70 55.13,70 55.13,23.25 0.13,23.25
GND on GND: 0,22.9 55,22.9 55,0 0,0
VCC on Top Layer: 4.92,7.04 -0.03,9.71 -0.03,21.32 7.4,21.32 7.75,20.98 7.75,18.56 7.49,18.18 4.74,18.18 3.77,17.21 3.77,12.64 4.83,11.58 4.02,10.78
VCC on Top Layer: 33.53,4.28 36.32,4.28 36.32,0.6 33.53,0.6
VCC on Top Layer: 33.53,21.23 36.32,21.23 36.32,17.55 33.53,17.55
VCC on Top Layer: 33.53,15.59 36.32,15.59 36.32,11.91 33.53,11.91
VCC on Top Layer: 4.44,11.83 2.97,10.36 2.97,7.04 4.8,7.04 8.76,3.07 9.74,3.07 9.74,4 7.35,6.39 7.35,11.75 7.27,11.83
VCC on Top Layer: 33.53,9.92 36.32,9.92 36.32,6.24 33.53,6.24
VCC on VCC: 0.26,69.74 54.74,69.74 54.74,0.26 0.26,0.26
(no net) on Bottom Layer: 41.78,19.96 42.61,19.96 42.61,18.21 41.78,18.21
MOTOR_L1 on Top Layer: 41.28,3.83 41.28,1.17 39.23,1.17 39.23,3.78 40.93,5.48 51.94,5.48 53.09,4.34 53.09,1.18 46.72,1.18 43.81,4.09 41.53,4.09
MOTOR_L1 on Top Layer: 36.81,3.01 36.81,1.31 39.23,1.31 39.23,1.18 40.36,1.18 40.36,0.63 40.76,0.63 40.76,1.18 41.23,1.18 41.23,3.78 40.77,3.78 40.77,4.29 40.37,4.29 40.37,3.78 39.23,3.78 39.23,3.66 38.58,3.66 38.58,3.26 38.33,3.01
MOTOR_L2 on Top Layer: 36.82,8.65 36.82,6.95 39.23,6.95 39.23,6.82 40.36,6.82 40.36,6.27 40.76,6.27 40.76,6.82 41.23,6.82 41.23,9.42 40.77,9.42 40.77,9.93 40.37,9.93 40.37,9.42 39.23,9.42 39.23,9.3 38.58,9.3 38.58,8.9 38.33,8.65
MOTOR_L2 on Top Layer: 39.23,6.82 39.23,9.3 41.14,11.22 51.71,11.22 53.11,9.82 53.11,6.65 46.48,6.65 43.31,9.82 41.66,9.82 41.28,9.44 41.28,6.82
MOTOR_R1 on Top Layer: 36.77,14.3 36.77,12.59 39.18,12.59 39.18,12.47 40.31,12.47 40.31,11.91 40.71,11.91 40.71,12.47 41.18,12.47 41.18,15.06 40.72,15.06 40.72,15.57 40.32,15.57 40.32,15.06 39.18,15.06 39.18,14.94 38.53,14.94 38.53,14.54 38.28,14.3
MOTOR_R1 on Top Layer: 41.18,15.02 41.18,12.5 39.21,12.5 39.21,15.02 40.83,16.65 51.58,16.65 53.09,15.14 53.09,11.81 47.78,11.81 44.07,15.52 41.68,15.52
MOTOR_R2 on Top Layer: 36.82,19.94 36.82,18.24 39.23,18.24 39.23,18.11 40.36,18.11 40.36,17.55 40.76,17.55 40.76,18.11 41.23,18.11 41.23,20.71 40.77,20.71 40.77,21.21 40.37,21.21 40.37,20.71 39.23,20.71 39.23,20.59 38.58,20.59 38.58,20.18 38.33,19.94
MOTOR_R2 on Top Layer: 39.23,18.1 39.23,20.58 41.14,22.5 51.71,22.5 53.11,21.1 53.11,16.91 47.5,16.91 43.31,21.1 41.66,21.1 41.28,20.72 41.28,18.1

Small or netless copper shapes (teardrops, artwork), in the pictures only: 212 on Top Layer, 16 on Bottom Layer
